# EasyEDA Pro project ProProject_TDeck_18650_Charger_2024-02-18.epro

# Schematic TDeck 18650 circuit
Create Date: 2024-02-16; Page Name: P1; Project Name: TDeck_18650_Charger; Schematic Name: Schematic1; Update Date: 2024-02-16; Company: Self; Drawn: NA; Page Size: A4; Part Number: JLCPCB-002; Reviewed: NA; Version: V0.1
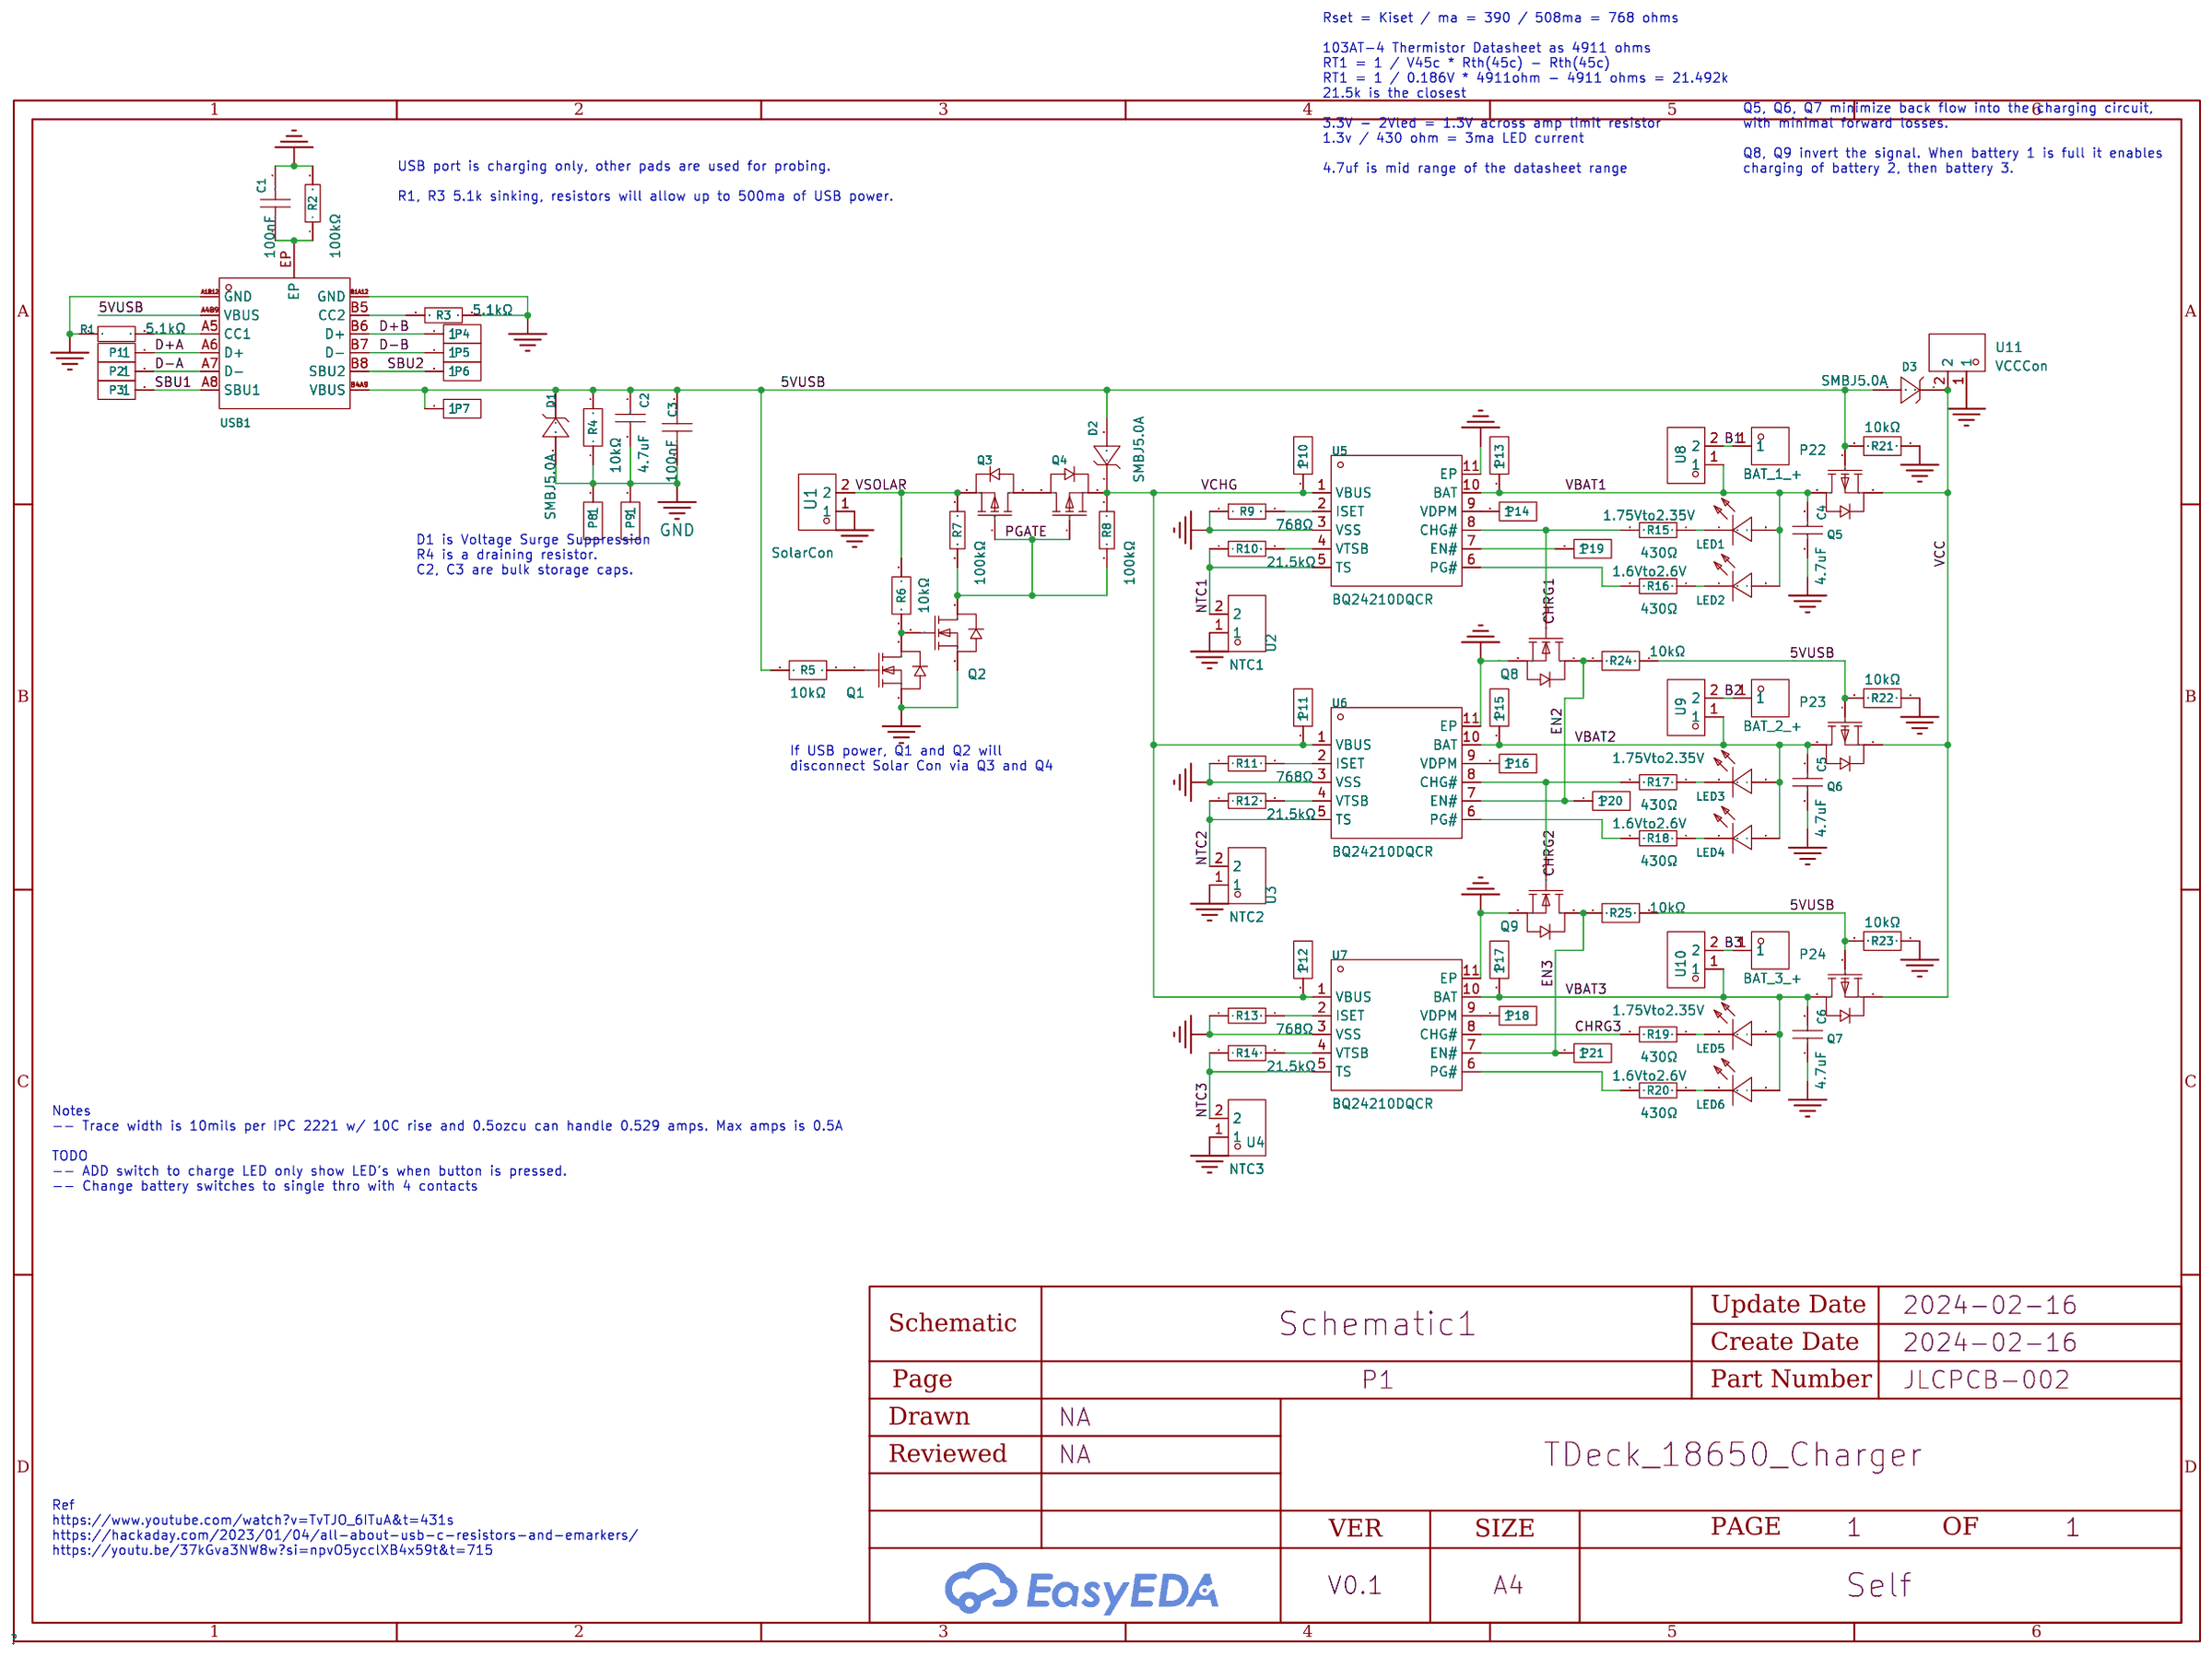
[diagram p0: schematic sheet]

## Parts
C1  100nF  [C0603]
C2  4.7uF  [C1206]
C3  100nF  [C0603]
C4  4.7uF  [C1206]
C5  4.7uF  [C1206]
C6  4.7uF  [C1206]
D1  SMBJ5.0A  [SMB_L4.4-W3.6-LS5.2-RD]
D2  SMBJ5.0A  [SMB_L4.4-W3.6-LS5.2-RD]
D3  SMBJ5.0A  [SMB_L4.4-W3.6-LS5.2-RD]
LED1  1.75Vto2.35V  [LED0805-RD_RED]
LED2  1.6Vto2.6V  [LED0603-RD]
LED3  1.75Vto2.35V  [LED0805-RD_RED]
LED4  1.6Vto2.6V  [LED0603-RD]
LED5  1.75Vto2.35V  [LED0805-RD_RED]
LED6  1.6Vto2.6V  [LED0603-RD]
P1  2.54-1*1P针  [HDR-SMD_1P-P2.54-V-M_XKB_R1]  (no BOM)
P2  2.54-1*1P针  [HDR-SMD_1P-P2.54-V-M_XKB_R1]  (no BOM)
P3  2.54-1*1P针  [HDR-SMD_1P-P2.54-V-M_XKB_R1]  (no BOM)
P4  2.54-1*1P针  [HDR-SMD_1P-P2.54-V-M_XKB_R1]  (no BOM)
P5  2.54-1*1P针  [HDR-SMD_1P-P2.54-V-M_XKB_R1]  (no BOM)
P6  2.54-1*1P针  [HDR-SMD_1P-P2.54-V-M_XKB_R1]  (no BOM)
P7  2.54-1*1P针  [HDR-TH_1P-P2.54-V-M]  (no BOM)
P8  2.54-1*1P针  [HDR-TH_1P-P2.54-V-M]
P9  2.54-1*1P针  [HDR-TH_1P-P2.54-V-M]
P10  2.54-1*1P针  [HDR-TH_1P-P2.54-V-M]
P11  2.54-1*1P针  [HDR-TH_1P-P2.54-V-M]
P12  2.54-1*1P针  [HDR-TH_1P-P2.54-V-M]
P13  2.54-1*1P针  [HDR-TH_1P-P2.54-V-M]
P14  2.54-1*1P针  [HDR-TH_1P-P2.54-V-M]  (no BOM)
P15  2.54-1*1P针  [HDR-TH_1P-P2.54-V-M]
P16  2.54-1*1P针  [HDR-TH_1P-P2.54-V-M]  (no BOM)
P17  2.54-1*1P针  [HDR-TH_1P-P2.54-V-M]
P18  2.54-1*1P针  [HDR-TH_1P-P2.54-V-M]  (no BOM)
P19  2.54-1*1P针  [HDR-TH_1P-P2.54-V-M]  (no BOM)
P20  2.54-1*1P针  [HDR-TH_1P-V-M]  (no BOM)
P21  2.54-1*1P针  [HDR-TH_1P-V-M]  (no BOM)
P22  BAT_1_+  [Battery_Pad+]
P23  BAT_2_+  [Battery_Pad+]
P24  BAT_3_+  [Battery_Pad+]
Q1  AO3400A  [SOT-23-3_L2.9-W1.6-P1.90-LS2.8-BR]
Q2  AO3400A  [SOT-23-3_L2.9-W1.6-P1.90-LS2.8-BR]
Q3  SI2301  [SOT-23-3_L2.9-W1.3-P1.90-LS2.4-BR]
Q4  SI2301  [SOT-23-3_L2.9-W1.3-P1.90-LS2.4-BR]
Q5  SI2301  [SOT-23-3_L2.9-W1.3-P1.90-LS2.4-BR]
Q6  SI2301  [SOT-23-3_L2.9-W1.3-P1.90-LS2.4-BR]
Q7  SI2301  [SOT-23-3_L2.9-W1.3-P1.90-LS2.4-BR]
Q8  AO3400A  [SOT-23-3_L2.9-W1.6-P1.90-LS2.8-BR]
Q9  AO3400A  [SOT-23-3_L2.9-W1.6-P1.90-LS2.8-BR]
R1  5.1kΩ  [R0805]
R2  100kΩ  [R0805]
R3  5.1kΩ  [R0805]
R4  10kΩ  [R0805]
R5  10kΩ  [R0805]
R6  10kΩ  [R0805]
R7  100kΩ  [R0805]
R8  100kΩ  [R0805]
R9  768Ω  [R0805]
R10  21.5kΩ  [R0805]
R11  768Ω  [R0805]
R12  21.5kΩ  [R0805]
R13  768Ω  [R0805]
R14  21.5kΩ  [R0805]
R15  430Ω  [R0603]
R16  430Ω  [R0603]
R17  430Ω  [R0603]
R18  430Ω  [R0603]
R19  430Ω  [R0603]
R20  430Ω  [R0603]
R21  10kΩ  [R0805]
R22  10kΩ  [R0805]
R23  10kΩ  [R0805]
R24  10kΩ  [R0805]
R25  10kΩ  [R0805]
U1  SolarCon  [CONN-TH_XY308-2.54-2P]
U2  NTC1  [HDR-TH_2P-P2.54-V-M-2]
U3  NTC2  [HDR-TH_2P-P2.54-V-M-2]
U4  NTC3  [HDR-TH_2P-P2.54-V-M-2]
U5  BQ24210DQCR  [WSON-10_L3.0-W2.0-P0.50-BL-EP]
U6  BQ24210DQCR  [WSON-10_L3.0-W2.0-P0.50-BL-EP]
U7  BQ24210DQCR  [WSON-10_L3.0-W2.0-P0.50-BL-EP]
U8  DIS-CON-SW  [HDR-TH_2P-P2.54-V-M-2]
U9  DIS-CON-SW  [HDR-TH_2P-P2.54-V-M-2]
U10  DIS-CON-SW  [HDR-TH_2P-P2.54-V-M-2]
U11  VCCCon  [HDR-TH_2P-P2.54-V-M-2]
USB1  TYPEC-304-ACP16  [USB-C-SMD_TYPE-C-16P-1]

## Library data of the parts
C1 C3 = CC0603KRX7R9BB104: Capacitance: Tolerance:±10% Tolerance:±10% Voltage Rated: Temperature Coefficient:; LCSC Part Name: 100nF ±10% 50V; Supplier Part: C14663; Manufacturer: YAGEO(国巨); Supplier Footprint: 0603; JLCPCB Part Class: Basic Part; Datasheet: https://atta.szlcsc.com/upload/public/pdf/source/20180910/C282072_33301C7F631E79921B82A8DAC6BCC5B3.pdf; Supplier: LCSC; Tolerance: ±10%
C2 C4-C6 = 1206B475K500NT: Capacitance:4.7uF Tolerance:±10% Tolerance:±10% Voltage Rated: Temperature Coefficient:; LCSC Part Name: 4.7uF ±10% 50V; Supplier Part: C29823; Manufacturer: FH(风华); Supplier Footprint: 1206; JLCPCB Part Class: Basic Part; Datasheet: https://atta.szlcsc.com/upload/public/pdf/source/20200305/C486355_26A10D38EF8C2A5C37091D0039909270.pdf; Supplier: LCSC; Tolerance: ±10%
D1-D3 = SMBJ5.0A_C3012487: Reverse Stand-Off Voltage (Vrwm):5V Maximum Clamping Voltage:9.2V Peak Pulse Current (Ipp)@10/1000us:65.3A Peak Pulse Power Dissipation (Ppp)@10/1000us:600W Breakdown Voltage:6.4V Reverse Leakage Current (Ir):500uA Type:TVS; Supplier Part: C3012487; Manufacturer: PAKER(派克微); Supplier Footprint: SMB; JLCPCB Part Class: Extended Part; Datasheet: https://atta.szlcsc.com/upload/public/pdf/source/20220607/3D2A7659A4820C4AE9AE78D6D582D662.pdf; Supplier: LCSC; Reverse Stand-Off Voltage (Vrwm): 5V; Maximum Clamping Voltage: 9.2V; Peak Pulse Current (Ipp)@10/1000us: 65.3A; Peak Pulse Power Dissipation (Ppp)@10/1000us: 600W; Breakdown Voltage: 6.4V; Reverse Leakage Current (Ir): 500uA; Type: TVS
LED1 LED3 LED5 = BL-HUF35A-AV-TRB: Emitted Color:Red; Supplier Part: C94741; Manufacturer: BrtLed(佰鸿); Supplier Footprint: 0805; JLCPCB Part Class: Extended Part; Datasheet: https://atta.szlcsc.com/upload/public/pdf/source/20170209/1486637565830.pdf; Supplier: LCSC; Emitted Color: Red
LED2 LED4 LED6 = NCD0603O2: Emitted Color:Orange Forward Voltage (VF):1.6V~2.6V Forward Voltage (VF):1.6V~2.6V Power Dissipation:65mW Forward Current:20mA Dominant Wavelength:600nm~610nm Dominant Wavelength:600nm~610nm Lens Color:无色透明透镜 Luminous Intensity:100mcd~220mcd Luminous Inte; Supplier Part: C108553; Manufacturer: 国星光电; Supplier Footprint: 0603; JLCPCB Part Class: Extended Part; Datasheet: https://atta.szlcsc.com/upload/public/pdf/source/20200820/C108553_1D8FD80A6A2BFA59936C6C85D97A3AAD.pdf; Supplier: LCSC; Emitted Color: Orange; Forward Voltage (VF): 1.6V~2.6V; Power Dissipation: 65mW; Forward Current: 20mA; Dominant Wavelength: 600nm~610nm; Lens Color: 无色透明透镜; Luminous Intensity: 100mcd~220mcd; Viewing Angle: 130°; Operating Temperature: -30℃~+85℃
P1-P7 P14 P16 P18-P21 = 2.54-1*1P针: Pin Structure:- Pitch:- Row Spacing:- Circluar Pins/Square Pins:- Mounting Type:Straight Number of Rows:Plugin Number of Pins:1P Current Rating (Max):- Voltage Rating (Max):- Length of Mating Pin:- Insulation Height:- Contact Material: Contact Plating:- C; LCSC Part Name: 直插; Supplier Part: C81276; Manufacturer: BOOMELE(博穆精密); Supplier Footprint: 插件,P=2.54mm; JLCPCB Part Class: Extended Part; Datasheet: https://atta.szlcsc.com/upload/public/pdf/source/20221018/3E9408392E35E6F57A28985E5F7BF5C9.pdf; Supplier: LCSC; Mounting Type: Straight; Number of Rows: Plugin; Number of Pins: 1P; Color: Black
P8-P13 P15 P17 = 2.54-1*1P针: Pin Structure:- Pitch:- Row Spacing:- Circluar Pins/Square Pins:- Mounting Type:Straight Number of Rows:Plugin Number of Pins:1P Current Rating (Max):- Voltage Rating (Max):- Length of Mating Pin:- Insulation Height:- Contact Material: Contact Plating:- C; LCSC Part Name: 直插; Supplier Part: C81276; Manufacturer: BOOMELE(博穆精密); Supplier Footprint: 插件,P=2.54mm; JLCPCB Part Class: Extended Part; Datasheet: https://atta.szlcsc.com/upload/public/pdf/source/20221018/3E9408392E35E6F57A28985E5F7BF5C9.pdf; Supplier: LCSC; Mounting Type: Straight; Number of Rows: Plugin; Number of Pins: 1P; Color: Black; Check: false
P22-P24 = PAD: Supplier Part: C9900017271; JLCPCB Part Class: Extended Part; Supplier: LCSC
Q1 Q2 Q8 Q9 = AO3400A_C20917: Type: Drain Source Voltage (Vdss): Continuous Drain Current (Id): Power Dissipation (Pd): Drain Source On Resistance (RDS(on)@Vgs,Id):26.5mΩ@10V,5.7A Gate Threshold Voltage (Vgs(th)@Id):1.5V@250uA Total Gate Charge (Qg@Vgs):7nC@4.5V Input Capacitance (Cis; LCSC Part Name: N沟道 耐压:30V 电流:5.7A; Supplier Part: C20917; Manufacturer: AOS; Supplier Footprint: SOT-23-3L; JLCPCB Part Class: Basic Part; Datasheet: https://atta.szlcsc.com/upload/public/pdf/source/20140107/1457706668533.pdf; Supplier: LCSC; Drain Source On Resistance (RDS(on)@Vgs,Id): 26.5mΩ@10V,5.7A; Gate Threshold Voltage (Vgs(th)@Id): 1.5V@250uA; Total Gate Charge (Qg@Vgs): 7nC@4.5V; Input Capacitance (Ciss@Vds): 630pF@15V; Operating Temperature: -55℃~+150℃@(Tj)
Q3-Q7 = SI2301_C2891731: Type: Drain Source Voltage (Vdss): Continuous Drain Current (Id): Power Dissipation (Pd): Drain Source On Resistance (RDS(on)@Vgs,Id):120mΩ@4.5V,1.5A Gate Threshold Voltage (Vgs(th)@Id):1.5V@250uA Total Gate Charge (Qg@Vgs):- Input Capacitance (Ciss@Vds):; LCSC Part Name: P沟道 耐压:20V 电流:2.2A; Supplier Part: C2891731; Manufacturer: YONGYUTAI(永裕泰); Supplier Footprint: SOT-23; JLCPCB Part Class: Extended Part; Datasheet: https://atta.szlcsc.com/upload/public/pdf/source/20210901/BD7F488CADB80954861F21BEE026F08A.pdf; Supplier: LCSC; Drain Source On Resistance (RDS(on)@Vgs,Id): 120mΩ@4.5V,1.5A; Gate Threshold Voltage (Vgs(th)@Id): 1.5V@250uA; Input Capacitance (Ciss@Vds): 200pF@10V
R1 R3 = 0805W8F5101T5E: Type:Thick Film Resistors Resistance:5.1kΩ Tolerance:±1% Tolerance:±1% Power(Watts): Overload Voltage (Max): Temperature Coefficient:±100ppm/℃ Temperature Coefficient:±100ppm/℃ Operating Temperature Range:-55℃~+155℃ Operating Temperature Range:-55℃~+155℃; LCSC Part Name: 5.1kΩ ±1% 125mW 厚膜电阻; Supplier Part: C27834; Manufacturer: UNI-ROYAL(厚声); Supplier Footprint: 0805; JLCPCB Part Class: Basic Part; Datasheet: https://atta.szlcsc.com/upload/public/pdf/source/20200306/C422600_1E6D84923E4A46A82E41ADD87F860B5C.pdf; Supplier: LCSC; Type: Thick Film Resistors; Tolerance: ±1%; Temperature Coefficient: ±100ppm/℃; Operating Temperature Range: -55℃~+155℃
R2 R7 R8 = 0805W8F1003T5E: Type:Thick Film Resistors Resistance:100kΩ Tolerance:±1% Tolerance:±1% Power(Watts): Overload Voltage (Max): Temperature Coefficient:±100ppm/℃ Temperature Coefficient:±100ppm/℃ Operating Temperature Range:-55℃~+155℃ Operating Temperature Range:-55℃~+155℃; LCSC Part Name: 100kΩ ±1% 125mW 厚膜电阻; Supplier Part: C149504; Manufacturer: UNI-ROYAL(厚声); Supplier Footprint: 0805; JLCPCB Part Class: Basic Part; Datasheet: https://atta.szlcsc.com/upload/public/pdf/source/20200306/C422600_1E6D84923E4A46A82E41ADD87F860B5C.pdf; Supplier: LCSC; Type: Thick Film Resistors; Tolerance: ±1%; Temperature Coefficient: ±100ppm/℃; Operating Temperature Range: -55℃~+155℃
R4-R6 R21-R25 = AR05DTD1002: Resistance: Tolerance:±0.5% Tolerance:±0.5% Temperature Coefficient:±50ppm/℃ Temperature Coefficient:±50ppm/℃; LCSC Part Name: 10kΩ ±0.5%; Supplier Part: C5120082; Manufacturer: Viking(光颉); Supplier Footprint: 0805; JLCPCB Part Class: Extended Part; Datasheet: https://atta.szlcsc.com/upload/public/pdf/source/20220808/FEB8974641219B05EC1DF578AF1AC27C.pdf; Supplier: LCSC; Tolerance: ±0.5%; Temperature Coefficient: ±50ppm/℃
R9 R11 R13 = AC0805FR-07768RL: Type:Thick Film Resistors Resistance: Tolerance:±1% Tolerance:±1% Power(Watts): Overload Voltage (Max): Temperature Coefficient:±100ppm/℃ Temperature Coefficient:±100ppm/℃ Operating Temperature Range:-55℃~+155℃ Operating Temperature Range:-55℃~+155℃; LCSC Part Name: 厚膜电阻 768Ω ±1% 125mW; Supplier Part: C228994; Manufacturer: YAGEO(国巨); Supplier Footprint: 0805; JLCPCB Part Class: Extended Part; Datasheet: https://atta.szlcsc.com/upload/public/pdf/source/20181114/C228994_9DA0DDEE46DCAF3B0853BD9682FC8FCE.pdf; Supplier: LCSC; Type: Thick Film Resistors; Tolerance: ±1%; Temperature Coefficient: ±100ppm/℃; Operating Temperature Range: -55℃~+155℃
R10 R12 R14 = CR0805-FX-2152ELF: Type:Thick Film Resistors Resistance: Tolerance:±1% Tolerance:±1% Power(Watts): Temperature Coefficient:±100ppm/℃ Temperature Coefficient:±100ppm/℃ Operating Temperature Range:-55℃~+155℃ Operating Temperature Range:-55℃~+155℃; LCSC Part Name: 厚膜电阻 21.5kΩ ±1% 125mW; Supplier Part: C203849; Manufacturer: BOURNS; Supplier Footprint: 0805; JLCPCB Part Class: Extended Part; Datasheet: https://atta.szlcsc.com/upload/public/pdf/source/20181212/C205087_1ACD03E1A16EE5293BD8A283223FEE72.pdf; Supplier: LCSC; Type: Thick Film Resistors; Tolerance: ±1%; Temperature Coefficient: ±100ppm/℃; Operating Temperature Range: -55℃~+155℃
R15-R20 = 0603WAF4300T5E: Type:Thick Film Resistors Resistance: Tolerance:±1% Tolerance:±1% Power(Watts): Overload Voltage (Max): Temperature Coefficient:±100ppm/℃ Temperature Coefficient:±100ppm/℃ Operating Temperature Range:-55℃~+155℃ Operating Temperature Range:-55℃~+155℃; LCSC Part Name: 430Ω ±1% 100mW 厚膜电阻; Supplier Part: C23170; Manufacturer: UNI-ROYAL(厚声); Supplier Footprint: 0603; JLCPCB Part Class: Extended Part; Datasheet: https://atta.szlcsc.com/upload/public/pdf/source/20200306/C422600_1E6D84923E4A46A82E41ADD87F860B5C.pdf; Supplier: LCSC; Type: Thick Film Resistors; Tolerance: ±1%; Temperature Coefficient: ±100ppm/℃; Operating Temperature Range: -55℃~+155℃
U1 = XY308-2.54-2P: Structure:1x2P Pitch:2.54mm Color:Green Mounting Style:Straight Current Rating (Max):6A Voltage Rating (Max):150V Number of Pins:2P Number of Rows:1 Wire Gauge - AWG:18~26 Wire Gauge - AWG:18~26 Wire Gauge - mm2:1 Wire Gauge - mm2:1 Number of PINs Per Row; LCSC Part Name: 2.54mm 1x2P 排数:1 每排P数:2 直插; Supplier Part: C557685; Manufacturer: XINLAIYA(新莱亚); Supplier Footprint: 插件,P=2.54mm; JLCPCB Part Class: Extended Part; Datasheet: https://atta.szlcsc.com/upload/public/pdf/source/20200527/C557686_13715264167F455C722D771DE12648FD.pdf; Supplier: LCSC; Structure: 1x2P; Pitch: 2.54mm; Color: Green; Mounting Style: Straight; Current Rating (Max): 6A; Voltage Rating (Max): 150V; Number of Pins: 2P; Number of Rows: 1; Wire Gauge - AWG: 18~26; Wire Gauge - mm2: 1; Number of PINs Per Row: 2
U2-U4 U8-U11 = 5-146472-2: Pitch:2.54mm Mounting Type:Straight Number of Rows:Plugin Number of Pins:2P Contact Plating:Gold Color:Black; LCSC Part Name: 间距:2.54mm 直插; Supplier Part: C6818945; Manufacturer: TE Connectivity(泰科电子); Supplier Footprint: 插件,P=2.54mm; Datasheet: https://atta.szlcsc.com/upload/public/pdf/source/231023/ENG_CD_146472_A1-a2ecdd3f4f0c38dab3630f573445b12b.pdf; Supplier: LCSC; Pitch: 2.54mm; Mounting Type: Straight; Number of Rows: Plugin; Number of Pins: 2P; Contact Plating: Gold; Color: Black
U5-U7 = BQ24210DQCR: Supplier Part: C524795; Manufacturer: TI(德州仪器); Supplier Footprint: WSON-10-EP(2x3); JLCPCB Part Class: Extended Part; Datasheet: https://www.ti.com/cn/lit/gpn/bq24210; Supplier: LCSC
USB1 = TYPEC-304-ACP16: Connector Type:Type-C Standard:- Gender:Female Number of Ports:1 Number of Contacts:16P Mounting Style:卧贴 Current Rating - Power (Max):3A Contact Material:Copper Contact Plating:Gold Operating Temperature Range:-40℃~+85℃ Operating Temperature Range:-40℃~+; LCSC Part Name: Type-C 母 卧贴; Supplier Part: C2982555; Manufacturer: XUNPU(讯普); Supplier Footprint: SMD; JLCPCB Part Class: Extended Part; Datasheet: https://atta.szlcsc.com/upload/public/pdf/source/20220311/3C907F75E12F45E4EE7F73565AB9C294.pdf; Supplier: LCSC; Connector Type: Type-C; Gender: Female; Number of Ports: 1; Number of Contacts: 16P; Mounting Style: 卧贴; Current Rating - Power (Max): 3A; Contact Material: Copper; Contact Plating: Gold; Operating Temperature Range: -40℃~+85℃

## Nets
5VUSB: C2.2 C3.2 D1.1 D2.2 D3.2 P7.1 Q5.1(G) Q6.1(G) Q7.1(G) R4.2 R5.2 R21.2 R22.2 R23.2 R24.2 R25.2 USB1.A4B9(VBUS) USB1.B4A9(VBUS)
GND: C1.2 C2.1 C3.1 C4.1 C5.1 C6.1 D1.2 P8.1 P9.1 Q1.2(S) Q2.2(S) Q8.2(S) Q9.2(S) R1.1 R2.2 R3.2 R4.1 R9.1 R11.1 R13.1 R21.1 R22.1 R23.1 U1.1 U2.1 U3.1 U4.1 U5.3(VSS) U5.11(EP) U6.3(VSS) U6.11(EP) U7.3(VSS) U7.11(EP) U11.1 USB1.A1B12(GND) USB1.B1A12(GND)
VBAT1: C4.2 LED1.2(A) LED2.2(A) P13.1 Q5.3(D) U5.10(BAT) U8.1
VBAT2: C5.2 LED3.2(A) LED4.2(A) P15.1 Q6.3(D) U6.10(BAT) U9.1
VBAT3: C6.2 LED5.2(A) LED6.2(A) P17.1 Q7.3(D) U7.10(BAT) U10.1
VCC: D3.1 Q5.2(S) Q6.2(S) Q7.2(S) U11.2
B1: P22.1 U8.2
B2: P23.1 U9.2
B3: P24.1 U10.2
CHRG1: Q8.1(G) R15.2 U5.8(CHG#)
CHRG2: Q9.1(G) R17.2 U6.8(CHG#)
CHRG3: R19.2 U7.8(CHG#)
D+A: P1.1 USB1.A6(D+)
D+B: P4.1 USB1.B6(D+)
D-A: P2.1 USB1.A7(D-)
D-B: P5.1 USB1.B7(D-)
EN2: P20.1 Q8.3(D) R24.1 U6.7(EN#)
EN3: P21.1 Q9.3(D) R25.1 U7.7(EN#)
NTC1: R10.1 U2.2 U5.5(TS)
NTC2: R12.1 U3.2 U6.5(TS)
NTC3: R14.1 U4.2 U7.5(TS)
PGATE: Q2.3(D) Q3.1(G) Q4.1(G) R7.1 R8.1
SBU1: P3.1 USB1.A8(SBU1)
SBU2: P6.1 USB1.B8(SBU2)
VCHG: D2.1 P10.1 P11.1 P12.1 Q4.2(S) R8.2 U5.1(VBUS) U6.1(VBUS) U7.1(VBUS)
VSOLAR: Q3.2(S) R6.2 R7.2 U1.2
$1N867: LED2.1(K) R16.1
$1N906: LED1.1(K) R15.1
$1N1095: R16.2 U5.6(PG#)
$1N1336: R9.2 U5.2(ISET)
$1N1382: R10.2 U5.4(VTSB)
$1N1737: P19.1 U5.7(EN#)
$1N1739: P14.1 U5.9(VDPM)
$1N1977: R3.1 USB1.B5(CC2)
$1N1993: R1.2 USB1.A5(CC1)
$1N2563: C1.1 R2.1 USB1.EP
$1N3770: Q3.3(D) Q4.3(D)
$1N4133: Q1.3(D) Q2.1(G) R6.1
$1N4200: Q1.1(G) R5.1
$1N5234: LED4.1(K) R18.1
$1N5236: LED3.1(K) R17.1
$1N5240: R18.2 U6.6(PG#)
$1N5246: R11.2 U6.2(ISET)
$1N5248: R12.2 U6.4(VTSB)
$1N5252: P16.1 U6.9(VDPM)
$1N5913: LED6.1(K) R20.1
$1N5915: LED5.1(K) R19.1
$1N5919: R20.2 U7.6(PG#)
$1N5925: R13.2 U7.2(ISET)
$1N5927: R14.2 U7.4(VTSB)
$1N5931: P18.1 U7.9(VDPM)

## Notes on the sheet
- Rset = Kiset / ma = 390 / 508ma = 768 ohms
  103AT-4 Thermistor Datasheet as 4911 ohms
  RT1 = 1 / V45c * Rth(45c) - Rth(45c)
  RT1 = 1 / 0.186V * 4911ohm - 4911 ohms = 21.492k
  21.5k is the closest
  3.3V - 2Vled = 1.3V across amp limit resistor
  1.3v / 430 ohm = 3ma LED current
  4.7uf is mid range of the datasheet range
- Q5, Q6, Q7 minimize back flow into the charging circuit,
  with minimal forward losses.
  Q8, Q9 invert the signal. When battery 1 is full it enables
  charging of battery 2, then battery 3.
- USB port is charging only, other pads are used for probing.
  R1, R3 5.1k sinking, resistors will allow up to 500ma of USB power.
- D1 is Voltage Surge Suppression
  R4 is a draining resistor.
  C2, C3 are bulk storage caps.
- If USB power, Q1 and Q2 will
  disconnect Solar Con via Q3 and Q4
- Notes
  -- Trace width is 10mils per IPC 2221 w/ 10C rise and 0.5ozcu can handle 0.529 amps. Max amps is 0.5A
  TODO
  -- ADD switch to charge LED only show LED's when button is pressed.
  -- Change battery switches to single thro with 4 contacts
- Ref
  https://www.youtube.com/watch?v=TvTJO_6ITuA&t=431s
  https://hackaday.com/2023/01/04/all-about-usb-c-resistors-and-emarkers/
  https://youtu.be/37kGva3NW8w?si=npvO5ycclXB4x59t&t=715

# Board PCB1
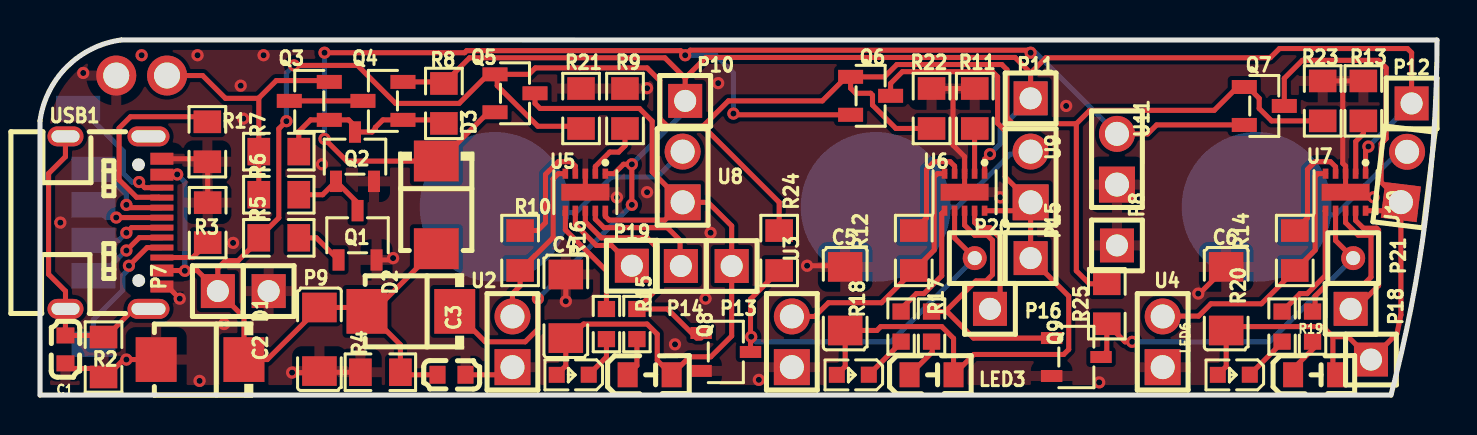
[diagram p1: board, top side]
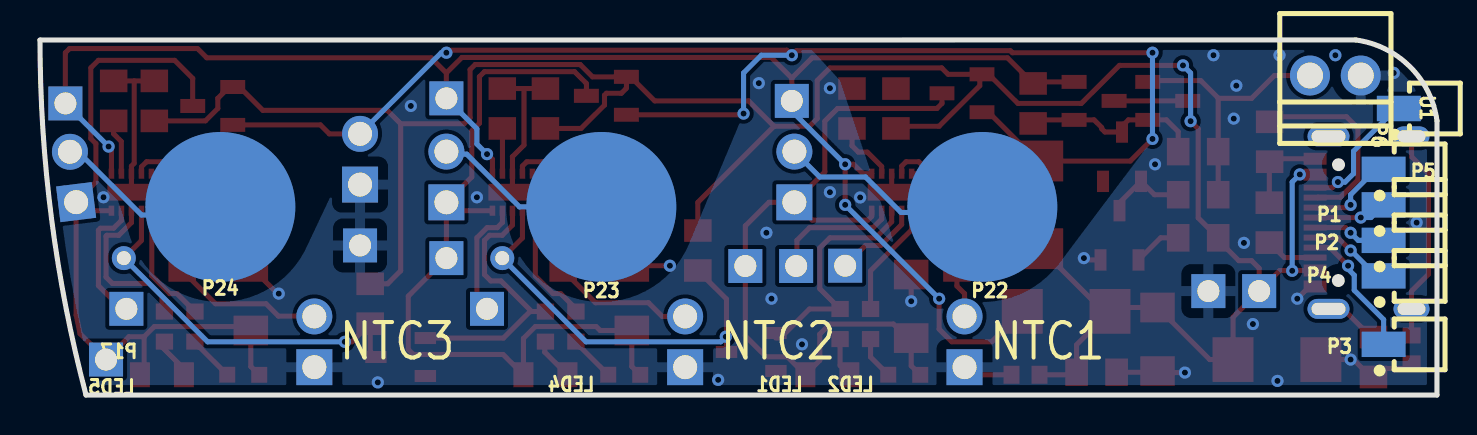
[diagram p2: board, bottom side, seen from below]

Outline 69.85 x 17.78 mm; copper layers: Top Layer, Bottom Layer. Coordinates in mm from the lower left corner of the outline.
Outline path: 0,13.73 arc(1.35,16.44) 4.07,17.78 69.85,17.78 arc(69.27,8.82) 67.55,0 0,0 0,13.73
Stack: Top Layer 0.035mm / Dielectric1 1.51mm FR4 er 4.5 / Bottom Layer 0.035mm

## Design rules (mm)
template: JLCPCB Capability(Two Layers Board)
spacing copperThickness1oz (default): track to track 0.102, other pairs 0.152 to 0.3
spacing copperThickness2oz: track to track 0.203, other pairs 0.152 to 0.3
track width copperThickness1oz (default): min 0.127, default 0.254, max 2.54
track width copperThickness2oz: min 0.203, default 0.254, max 2.54
differential pair differentialPair (default): width min 0.127, default 0.254, max 2.54; gap min 0.152, default 0.152
via viaSize (default): diameter min 0.5, default 0.61, max 10; hole min 0.3, default 0.305, max 6.3

## Placement (name value [footprint] x y rotation side)
C1  100nF  [C0603]  1.27 2.29 270 top
C2  4.7uF  [C1206]  13.97 2.79 90 top
C3  100nF  [C0603]  20.58 1.02 180 top
C4  4.7uF  [C1206]  26.29 4.45 270 top
C5  4.7uF  [C1206]  40.26 4.83 270 top
C6  4.7uF  [C1206]  59.31 4.83 270 top
D1  SMBJ5.0A  [SMB_L4.4-W3.6-LS5.2-RD]  8 1.78 180 top
D2  SMBJ5.0A  [SMB_L4.4-W3.6-LS5.2-RD]  18.54 4.19 180 top
D3  SMBJ5.0A  [SMB_L4.4-W3.6-LS5.2-RD]  19.81 9.53 270 top
LED1  1.75Vto2.35V  [LED0805-RD_RED]  30.48 1.02 0 top
LED2  1.6Vto2.6V  [LED0603-RD]  26.64 1.02 180 top
LED3  1.75Vto2.35V  [LED0805-RD_RED]  44.58 1.02 0 top
LED4  1.6Vto2.6V  [LED0603-RD]  40.64 1.02 180 top
LED5  1.75Vto2.35V  [LED0805-RD_RED]  63.76 1.02 0 top
LED6  1.6Vto2.6V  [LED0603-RD]  59.69 1.02 180 top
P1  2.54-1*1P针  [HDR-SMD_1P-P2.54-V-M_XKB_R1]  2.67 9.53 90 bottom
P2  2.54-1*1P针  [HDR-SMD_1P-P2.54-V-M_XKB_R1]  2.67 7.75 90 bottom
P3  2.54-1*1P针  [HDR-SMD_1P-P2.54-V-M_XKB_R1]  2.67 2.54 90 bottom
P4  2.54-1*1P针  [HDR-SMD_1P-P2.54-V-M_XKB_R1]  2.67 5.97 90 bottom
P5  2.54-1*1P针  [HDR-SMD_1P-P2.54-V-M_XKB_R1]  2.67 11.3 90 bottom
P6  2.54-1*1P针  [HDR-SMD_1P-P2.54-V-M_XKB_R1]  1.91 14.35 90 bottom
P7  2.54-1*1P针  [HDR-TH_1P-P2.54-V-M]  8.89 5.21 90 top
P8  2.54-1*1P针  [HDR-TH_1P-P2.54-V-M]  53.85 7.49 0 top
P9  2.54-1*1P针  [HDR-TH_1P-P2.54-V-M]  11.43 5.21 0 top
P10  2.54-1*1P针  [HDR-TH_1P-P2.54-V-M]  32.26 14.73 270 top
P11  2.54-1*1P针  [HDR-TH_1P-P2.54-V-M]  49.53 14.86 270 top
P12  2.54-1*1P针  [HDR-TH_1P-P2.54-V-M]  68.58 14.61 270 top
P13  2.54-1*1P针  [HDR-TH_1P-P2.54-V-M]  34.58 6.46 270 top
P14  2.54-1*1P针  [HDR-TH_1P-P2.54-V-M]  32.04 6.46 270 top
P15  2.54-1*1P针  [HDR-TH_1P-P2.54-V-M]  49.53 6.86 270 top
P16  2.54-1*1P针  [HDR-TH_1P-P2.54-V-M]  47.5 4.32 270 top
P17  2.54-1*1P针  [hdr-th_1p-p2.54-v-m]  66.55 1.78 270 top
P18  2.54-1*1P针  [HDR-TH_1P-P2.54-V-M]  65.53 4.32 270 top
P19  2.54-1*1P针  [HDR-TH_1P-P2.54-V-M]  29.59 6.48 270 top
P20  2.54-1*1P针  [HDR-TH_1P-V-M]  46.74 6.86 270 top
P21  2.54-1*1P针  [HDR-TH_1P-V-M]  65.66 6.86 270 top
P22  BAT_1_+  [Battery_Pad+]  22.73 9.42 270 bottom
P23  BAT_2_+  [Battery_Pad+]  41.78 9.42 270 bottom
P24  BAT_3_+  [Battery_Pad+]  60.83 9.42 270 bottom
Q1  AO3400A  [SOT-23-3_L2.9-W1.6-P1.90-LS2.8-BR]  15.88 8 270 top
Q2  AO3400A  [SOT-23-3_L2.9-W1.6-P1.90-LS2.8-BR]  15.75 11.94 270 top
Q3  SI2301  [SOT-23-3_L2.9-W1.3-P1.90-LS2.4-BR]  13.46 14.73 0 top
Q4  SI2301  [SOT-23-3_L2.9-W1.3-P1.90-LS2.4-BR]  17.15 14.73 0 top
Q5  SI2301  [SOT-23-3_L2.9-W1.3-P1.90-LS2.4-BR]  23.75 15.11 180 top
Q6  SI2301  [SOT-23-3_L2.9-W1.3-P1.90-LS2.4-BR]  41.53 14.99 180 top
Q7  SI2301  [SOT-23-3_L2.9-W1.3-P1.90-LS2.4-BR]  61.22 14.48 180 top
Q8  AO3400A  [SOT-23-3_L2.9-W1.6-P1.90-LS2.8-BR]  34.29 2.16 180 top
Q9  AO3400A  [SOT-23-3_L2.9-W1.6-P1.90-LS2.8-BR]  51.82 1.91 180 top
R1  5.1kΩ  [R0805]  8.37 12.68 90 top
R2  100kΩ  [R0805]  3.18 1.91 270 top
R3  5.1kΩ  [R0805]  8.38 8.64 90 top
R4  10kΩ  [R0805]  17.02 1.14 0 top
R5  10kΩ  [R0805]  11.94 7.87 180 top
R6  10kΩ  [R0805]  11.94 10.03 180 top
R7  100kΩ  [R0805]  11.94 12.19 180 top
R8  100kΩ  [R0805]  20.2 14.61 90 top
R9  768Ω  [R0805]  29.25 14.35 270 top
R10  21.5kΩ  [R0805]  24 7.24 90 top
R11  768Ω  [R0805]  46.74 14.35 270 top
R12  21.5kΩ  [R0805]  43.69 7.24 90 top
R13  768Ω  [R0805]  66.17 14.73 270 top
R14  21.5kΩ  [R0805]  62.74 7.24 90 top
R15  430Ω  [R0603]  29.85 3.56 90 top
R16  430Ω  [R0603]  28.32 3.56 90 top
R17  430Ω  [R0603]  44.58 3.43 90 top
R18  430Ω  [R0603]  43.05 3.43 90 top
R19  430Ω  [R0603]  63.63 3.43 90 top
R20  430Ω  [R0603]  62.11 3.43 90 top
R21  10kΩ  [R0805]  27.05 14.35 270 top
R22  10kΩ  [R0805]  44.58 14.35 270 top
R23  10kΩ  [R0805]  64.14 14.73 270 top
R24  10kΩ  [R0805]  36.96 7.24 90 top
R25  10kΩ  [R0805]  53.34 4.57 90 top
U1  SolarCon  [CONN-TH_XY308-2.54-2P]  5.08 16 0 bottom
U2  NTC1  [HDR-TH_2P-P2.54-V-M-2]  23.62 2.67 0 top
U3  NTC2  [HDR-TH_2P-P2.54-V-M-2]  37.59 2.67 0 top
U4  NTC3  [HDR-TH_2P-P2.54-V-M-2]  56.14 2.67 0 top
U5  BQ24210DQCR  [WSON-10_L3.0-W2.0-P0.50-BL-EP]  27.27 10.16 180 top
U6  BQ24210DQCR  [WSON-10_L3.0-W2.0-P0.50-BL-EP]  46.23 10.16 180 top
U7  BQ24210DQCR  [WSON-10_L3.0-W2.0-P0.50-BL-EP]  65.28 10.16 180 top
U8  DIS-CON-SW  [HDR-TH_2P-P2.54-V-M-2]  32.13 10.92 0 top
U9  DIS-CON-SW  [HDR-TH_2P-P2.54-V-M-2]  49.53 10.92 0 top
U10  DIS-CON-SW  [HDR-TH_2P-P2.54-V-M-2]  68.2 10.92 353 top
U11  VCCCon  [HDR-TH_2P-P2.54-V-M-2]  53.85 11.81 0 top
USB1  TYPEC-304-ACP16  [USB-C-SMD_TYPE-C-16P-1]  3.69 8.64 270 top

## Footprints (pads in the part's own frame, mm; a bottom-side part is the same pattern mirrored in y, then rotated)
Battery_Pad+
  round 7.5 smd: 1(0,0)
C0603
  rect 0.8x0.9 smd: 1(-0.7,0) 2(0.7,0)
C1206
  rect 1.485x1.728 smd: 1(-1.593,0) 2(1.593,0)
CONN-TH_XY308-2.54-2P
  round 2 hole 1.3: 1(-1.27,0) 2(1.27,0)
HDR-SMD_1P-P2.54-V-M_XKB_R1
  rect 1.27x2.2 smd: 1(0,0)
hdr-th_1p-p2.54-v-m
  rect 1.7x1.7 hole 1.1: 1(0,0)
HDR-TH_1P-P2.54-V-M
  rect 1.7x1.7 hole 1.1: 1(0,0)
HDR-TH_1P-V-M
  round 1.2 hole 0.7: 1(0,0)
HDR-TH_2P-P2.54-V-M-2
  rect 1.8x1.8 hole 1.2: 1(0,-1.27)
  round 1.8 hole 1.2: 2(0,1.27)
LED0603-RD
  rect 0.8x0.8 smd: 1(-0.799,-0.004) 2(0.799,0.004)
LED0805-RD_RED
  rect 1x1.25 smd: 1(-1.1,0) 2(1.1,0)
R0603
  rect 0.806x0.864 smd: 1(-0.753,0) 2(0.753,0)
R0805
  rect 1.133x1.377 smd: 1(-1,0) 2(1,0)
SMB_L4.4-W3.6-LS5.2-RD
  rect 2.047x2.241 smd: 1(-2.195,0) 2(2.195,0)
SOT-23-3_L2.9-W1.3-P1.90-LS2.4-BR
  rect 1.25x0.7 smd: 1(1,-0.95) 2(1,0.95) 3(-1,0)
SOT-23-3_L2.9-W1.6-P1.90-LS2.8-BR
  rect 1.07x0.6 smd: 1(1.235,-0.95) 2(1.235,0.95) 3(-1.235,0)
USB-C-SMD_TYPE-C-16P-1
  rect 0.6x1.15 smd: A1B12(-3.2,2.41) A4B9(-2.4,2.41) B1A12(3.2,2.41) B4A9(2.4,2.41)
  rect 0.3x1.15 smd: A5(-1.25,2.41) A6(-0.25,2.41) A7(0.25,2.41) A8(1.25,2.41) B5(1.75,2.41) B6(0.75,2.41) B7(-0.75,2.41) B8(-1.75,2.41)
  oval 1x2.1 hole 0.6x1.7: EP(-4.32,1.74) EP(4.32,1.74)
  oval 1x1.8 hole 0.6x1.4: EP(-4.32,-2.41) EP(4.32,-2.41)
WSON-10_L3.0-W2.0-P0.50-BL-EP
  rect 0.28x0.505 smd: 1(-1,-0.927) 2(-0.5,-0.927) 3(0,-0.927) 4(0.5,-0.927) 5(1,-0.927) 6(1,0.927) 7(0.5,0.927) 8(0,0.927) 9(-0.5,0.927) 10(-1,0.927)
  rect 2.4x0.84 smd: 11(0,0)

## Nets
As in the schematic.

## Via types
v1: diameter 0.61, hole 0.305, Top Layer to Bottom Layer, 52 vias

## Routing (per net, layer and track width the routed paths; a pad name or vN(x,y) marks a point on that pad's centre or on a via; arc(x,y) is an arc through that point)
5VUSB: length 132.5
  Top Layer w0.254: Q6.1 40.53,15.37 40.78,15.11 41.53,15.11 41.63,15.02 41.63,14.52 42.8,13.35 R22.2 ; Q6.1 40.32,15.94 39.12,14.73 34.42,14.73 33.15,13.46 ; Q6.1 42.23,15.94 42.84,16.55 48.09,16.55 48.35,16.3 48.35,13.88 48.64,13.59 51.82,13.59 ; v1(7.24,6.22) 7,6.22 6.99,6.24 ; 51.82,13.59 51.82,6.22 52.47,5.57 R25.2 ; 51.82,13.59 52.49,14.26 58.71,14.26 59.88,15.43 Q7.1 60.39,15.43 60.96,14.86 60.96,14.35 61.58,13.73 R23.2 ; USB1.A4B9 6.85,11.04 v1(6.86,11.05) ; v1(12.32,13.72) 11.94,13.34 11.94,8.87 R5.2 10.94,7.76 9.91,6.73 9.27,6.73 8.89,6.35 P7.1 ; R24.2 36.96,9.65 33.15,13.46 ; 6.99,6.24 7.86,6.24 P7.1 ; 6.99,6.24 USB1.B4A9 5.97,6.24 ; 33.15,13.46 31.37,13.46 30.99,13.84 30.99,15.75 30.36,16.38 24.77,16.38 24.45,16.06 Q5.1 ; P7.1 10.2,3.9 D1.1 11.36,1.78 C2.2 16.15,4.39 D2.2 ; Q5.1 22.86,15.95 22.86,15.49 24.89,13.46 27.05,13.46 ; Q5.1 22.42,16.06 20.96,14.61 17.78,14.61 15.88,16.51 v1(12.7,16.51) ; D2.2 18.02,2.52 R4.2 18.15,1.02 19.75,1.02 ; D2.2 16.67,4.19 D3.2
  Bottom Layer w0.254: v1(12.32,13.72) 12.32,16.13 v1(12.7,16.51) ; v1(7.24,6.22) 7.24,10.67 v1(6.86,11.05)
GND: length 39.1
  Top Layer w0.254: U7.11 U7.3 65.28,11.47 65.14,11.61 65.14,15.73 ; R23.1 65.14,15.73 ; 65.14,15.73 R13.1 ; U2.1 23.24,1.02 C3.1 ; v1(57.91,5.08) 57.97,5.08 C6.1 ; C4.1 v1(26.29,4.7) ; 5.97,5.44 6.38,5.44 v1(6.99,4.83) ; U6.11 U6.3 46.23,11.94 45.65,12.52 45.65,15.35 ; R22.1 45.65,15.35 ; 45.65,15.35 R11.1 ; v1(17.66,6.86) 17.56,6.77 Q1.2 ; D1.2 v1(4.32,1.78) 4.18,1.78 3.18,0.78 2.62,1.33 1.27,1.33 ; v1(38.36,6.48) 40.2,6.48 C5.1 ; v1(12.6,1.13) 13.9,1.13 C2.1 14.03,1.14 R4.1 ; 5.97,11.84 7.98,11.84 8.38,11.43 R3.2 ; 27.27,11.09 U5.11
  vias: v1(1.02,8.64) v1(2.16,16.13) v1(5.08,17.02) v1(7.88,17.02) v1(7.98,0.71) v1(9.2,3.56) v1(9.65,7.62) v1(10.03,15.49) v1(10.16,13.84) v1(11.18,17.02) v1(14.1,11.56) v1(28.84,9.9) v1(30.36,15.37) v1(30.36,10.16) v1(31.75,2.54) v1(33.28,4.83) v1(33.53,8.13) v1(33.91,15.62) v1(35.94,0.76) v1(48.01,9.91) v1(51.31,14.48) v1(52.96,0.64) v1(66.68,9.91)
VBAT1: length 37.7
  Top Layer w0.254: LED2.2 26.29,1.47 C4.2 26.48,2.85 27.18,3.56 30.36,3.56 30.86,3.05 30.86,1.73 LED1.2 32.48,1.92 33.54,1.92 34.58,2.96 P13.1 34.58,8.47 33.4,9.65 U8.1 ; U8.1 31.24,8.76 28.45,8.76 28.27,8.95 U5.10 ; U8.1 30.61,11.18 30.61,13.72 29.97,14.35 25,14.35 24.75,14.61 Q5.3
VBAT2: length 40.2
  Top Layer w0.254: U9.1 49.11,9.23 U6.10 ; U9.1 48.26,10.92 48.26,13.23 47.88,13.61 47.88,15.94 47.63,16.2 43.12,16.2 42.53,15.61 Q6.3 ; U9.1 P15.1 51.44,4.95 51.44,2.29 51.18,2.03 46.7,2.03 LED3.2 45.68,2.84 45.09,3.43 42.04,3.43 41.84,3.23 C5.2 40.26,1.43 LED4.2
VBAT3: length 37.1
  Top Layer w0.254: 64.64,2.92 64.64,1.23 LED5.2 ; 64.64,2.92 64.14,3.43 59.51,3.43 C6.2 59.31,1.43 LED6.2 ; 64.64,2.92 65.41,2.92 P17.1 67.85,3.08 arc(67.95,3.55) 68.05,4.01 68.05,9.65 ; 68.05,9.65 U10.1 ; 68.05,9.65 68.07,9.65 67.06,10.67 67.06,12.59 67.31,12.85 67.31,16.38 66.93,16.76 63.12,16.76 62.22,15.86 Q7.3 ; 68.05,9.65 67.95,9.65 67.53,9.23 U7.10
VCC: length 73.2
  Top Layer w0.254: U11.2 55.39,13.08 55.83,13.53 Q7.2 ; v1(14.23,17.14) 21.23,17.14 21.33,17.25 32.03,17.25 v1(32.26,17.02) 32.51,17.27 49.4,17.27 v1(49.53,17.14) ; v1(34.67,14.1) 34.73,14.04 Q6.2 ; v1(14.23,12.83) 15.33,11.72 D3.1 19.98,11.72 22.42,14.16 Q5.2
  Bottom Layer w0.254: v1(34.67,14.1) 34.67,16.13 33.78,17.02 v1(32.26,17.02) ; v1(49.53,17.14) 49.79,17.14 U11.2 ; v1(14.23,12.83) v1(14.23,17.14)
B1: length 10.8
  Bottom Layer w0.254: P22.1 23.01,9.14 26.8,9.14 28.58,10.92 30.86,10.92 U8.2
B2: length 8.9
  Bottom Layer w0.254: P23.1 45.87,9.42 48.52,12.06 49.4,12.06 U9.2
B3: length 9
  Bottom Layer w0.254: P24.1 61.24,9.02 64.77,9.02 67.94,12.18 U10.2
CHRG1: length 12
  Top Layer w0.254: 33.06,2.86 32.83,2.86 31.38,4.31 R15.2 30.86,5.33 30.86,7.37 30.36,7.87 28.07,7.87 27.27,8.68 U5.8
CHRG2: length 13.8
  Top Layer w0.254: 45.27,4.18 R17.2 ; 45.27,4.18 46.8,5.72 47.31,5.72 47.63,6.03 47.63,7.75 47.37,8 46.74,8 46.23,8.51 U6.8 ; 45.27,4.18 45.35,4.18 46.68,2.86 Q9.1
CHRG3: length 8.2
  Top Layer w0.254: U7.8 65.28,8.64 65.92,8 66.51,8 66.55,7.96 66.55,5.91 66.23,5.59 64.39,5.59 63.76,4.95 63.76,4.31 R19.2
D+A: length 3.7
  Top Layer w0.254: USB1.A6 3.82,8.89 v1(3.81,8.89)
  Bottom Layer w0.254: v1(3.81,8.89) 3.3,8.89 P1.1
D+B: length 4.2
  Top Layer w0.254: USB1.B6 4.97,7.89 v1(4.32,7.24)
  Bottom Layer w0.254: P4.1 3.03,5.97 4.3,7.24 v1(4.32,7.24)
D-A: length 3.7
  Top Layer w0.254: v1(4.32,8.13) 4.58,8.39 USB1.A7
  Bottom Layer w0.254: v1(4.32,8.13) 3.94,7.75 P2.1
D-B: length 4.5
  Top Layer w0.254: USB1.B7 4.46,9.39 v1(4.32,9.53)
  Bottom Layer w0.254: v1(4.32,9.53) 4.32,10.03 3.05,11.3 P5.1
EN2: length 20.8
  Top Layer w0.254: 35.53,2.64 35.56,2.67 v1(35.56,2.92) ; 35.53,2.64 35.53,4.81 R24.1 ; 35.53,2.64 Q8.3 ; U6.7 45.73,7.87 P20.1
  Bottom Layer w0.254: v1(35.56,2.92) 35.82,2.67 42.55,2.67 P20.1
EN3: length 19
  Top Layer w0.254: v1(54.61,2.67) 54.25,2.67 53.34,3.58 53.34,2.19 Q9.3 ; U7.7 64.78,7.74 P21.1
  Bottom Layer w0.254: v1(54.61,2.67) 61.47,2.67 P21.1
NTC1: length 8.5
  Top Layer w0.254: 26.27,11.09 25.91,11.09 25.66,10.83 25.66,7.89 R10.1 24,5.46 23.62,5.08 U2.2
NTC2: length 12.7
  Top Layer w0.254: U6.5 44.87,11.09 44.71,10.92 44.71,7.25 R12.1 42.07,4.62 39.42,4.62 38.74,3.94 U3.2
NTC3: length 13.2
  Top Layer w0.254: 56.21,3.95 57.93,3.95 58.55,4.57 61.07,4.57 R14.1 63.76,7.25 63.76,10.96 63.88,11.09 U7.5
PGATE: length 9.3
  Top Layer w0.254: R7.1 12.94,13.19 13.53,13.78 Q3.1 15.43,13.78 15.75,13.46 Q2.3 16.6,13.17 16.77,13.34 16.77,13.4 17.15,13.78 20.02,13.78 R8.1
SBU1: length 6.7
  Top Layer w0.254: v1(4.45,6.48) 5.36,7.39 USB1.A8
  Bottom Layer w0.254: v1(4.45,6.48) 4.45,6.31 4.14,6 4.14,5.25 2.67,3.78 P3.1
SBU2: length 6.5
  Top Layer w0.254: v1(4.95,10.67) 5.24,10.39 USB1.B8
  Bottom Layer w0.254: v1(4.95,10.67) 4.6,10.67 4.17,11.09 4.17,12.21 2.03,14.35 P6.1
VCHG: length 88
  Top Layer w0.254: 49.53,16.13 50.29,16.89 61.51,16.89 61.98,17.35 68.37,17.35 68.58,17.14 P12.1 ; 49.53,16.13 48.75,16.91 33.29,16.91 32.26,15.88 ; 49.53,16.13 P11.1 ; v1(29.59,9.53) v1(29.59,11.56) 29.17,11.56 28.7,11.09 28.27,11.09 ; v1(24.89,4.83) 24.89,3.3 24.26,2.67 22.26,2.67 D2.1 ; 32.26,15.88 31.24,16.89 21.48,16.89 R8.2 20.12,15.68 18.15,15.68 ; 32.26,15.88 P10.1 ; U6.1 47.23,11.81 47.48,12.06 v1(47.5,12.06) ; v1(66.42,12.45) 66.28,12.3 U7.1
  Bottom Layer w0.254: v1(29.59,11.56) 32.26,14.22 P10.1 ; v1(66.42,12.45) P12.1 ; P11.1 48.01,13.34 48.01,12.57 v1(47.5,12.06) ; v1(29.59,9.53) v1(24.89,4.83)
VSOLAR: length 13.8
  Top Layer w0.254: 10.94,14.86 9.27,14.86 8.13,16 U1.2 ; 10.94,14.86 R7.2 R6.2 ; 10.94,14.86 10.94,14.88 11.81,15.75 14.4,15.75 Q3.2
$1N867: length 2.1
  Top Layer w0.254: R16.1 28.32,1.91 LED2.1
$1N906: length 2
  Top Layer w0.254: R15.1 29.85,1.48 LED1.1
$1N1095: length 5.8
  Top Layer w0.254: R16.2 28.32,6.22 26.27,8.28 U5.6
$1N1336: length 3.1
  Top Layer w0.254: R9.2 29.25,12.48 28.93,12.17 28.49,12.17 27.77,11.45 27.77,11.09
$1N1382: length 6.1
  Top Layer w0.254: R10.2 24.88,8.24 25.27,8.64 25.27,11.05 25.91,11.68 26.55,11.68 26.77,11.47 26.77,11.09
$1N1737: length 4.4
  Top Layer w0.254: P19.1 28.58,7.49 27.81,7.49 26.77,8.54 26.77,9.23
$1N1739: length 6.4
  Top Layer w0.254: 27.77,9.23 27.77,8.81 28.2,8.38 31.37,8.38 32.01,7.75 32.01,6.5 P14.1
$1N1977: length 2.7
  Top Layer w0.254: R3.1 7.63,6.89 5.97,6.89
$1N1993: length 9.7
  Top Layer w0.254: R1.2 8.25,13.68 7.99,13.94 4.52,13.94 3.95,13.37 3.95,10.78 4.83,9.91 5.95,9.91 5.97,9.89
$1N2563: length 15.5
  Top Layer w0.254: 1.27,12.96 1.27,12.95 1.27,11.94 0.43,11.09 0.43,6.05 1.27,5.2 1.27,4.32 ; 1.15,4.32 1.27,4.19 C1.1 3.1,2.99 R2.1 3.29,2.91 4.7,4.32 USB1.EP
$1N3770: length 3.7
  Top Layer w0.254: Q3.3 Q4.3
$1N4133: length 4.1
  Top Layer w0.254: Q1.3 15.88,9.63 Q2.1 14.13,10.03 R6.1
$1N4200: length 2.4
  Top Layer w0.254: R5.1 13.82,7.87 Q1.1
$1N5234: length 2.3
  Top Layer w0.254: LED4.1 43.05,2.63 R18.1
$1N5236: length 2.2
  Top Layer w0.254: LED3.1 44.61,2.15 44.61,2.68 R17.1
$1N5240: length 6.2
  Top Layer w0.254: U6.6 45.09,9.09 45.09,5.97 44.2,5.08 43.82,5.08 43.05,4.32 R18.2
$1N5246: length 2.3
  Top Layer w0.254: U6.2 46.73,13.34 R11.2
$1N5248: length 5.4
  Top Layer w0.254: R12.2 44.33,8.87 44.33,11.3 44.71,11.68 45.51,11.68 45.73,11.47 U6.4
$1N5252: length 6
  Top Layer w0.254: U6.9 46.73,8.64 46.99,8.38 47.5,8.38 48.01,7.87 48.01,4.83 P16.1
$1N5913: length 2.3
  Top Layer w0.254: LED6.1 62.11,2.63 R20.1
$1N5915: length 2.4
  Top Layer w0.254: R19.1 63.76,2.68 63.89,2.54 62.66,1.31 LED5.1
$1N5919: length 6.2
  Top Layer w0.254: R20.2 63,5.08 63.36,5.08 64.26,5.98 64.26,9.22 U7.6
$1N5925: length 2.8
  Top Layer w0.254: U7.2 65.79,11.1 65.79,12.7 66.17,13.08 R13.2
$1N5927: length 5.3
  Top Layer w0.254: R14.2 63.37,8.87 63.37,11.3 63.76,11.68 64.53,11.68 64.78,11.43 U7.4
$1N5931: length 6.6
  Top Layer w0.254: 65.41,4.32 65.9,4.81 66.26,4.81 66.93,5.48 66.93,8.25 66.83,8.36 66.17,8.36 65.78,8.75 U7.9

## Copper pours and planes (outline as drawn; the poured copper is in the pictures)
GND on Top Layer: -0.38,18.16 70.36,18.16 70.36,-0.51 -0.38,-0.51
GND on Bottom Layer: -0.63,18.42 70.61,18.42 70.61,-0.76 -0.63,-0.76

## Text on the board
Bottom Silkscreen Layer: NTC2 | NTC3 | NTC1
